# Altium project Beta_Prototype_Main_Board.PrjPcb (part 2 of 2)

## Sheet ShinStrap_Interface.SchDoc
size A3; Organization: Altium Limited; Address1: L3, 12a Rodborough Rd; Address2: Frenchs Forest; Address3: NSW; Address4: Australia 2086; DocumentNumber: 7; SheetNumber: 7; SheetTotal: 8
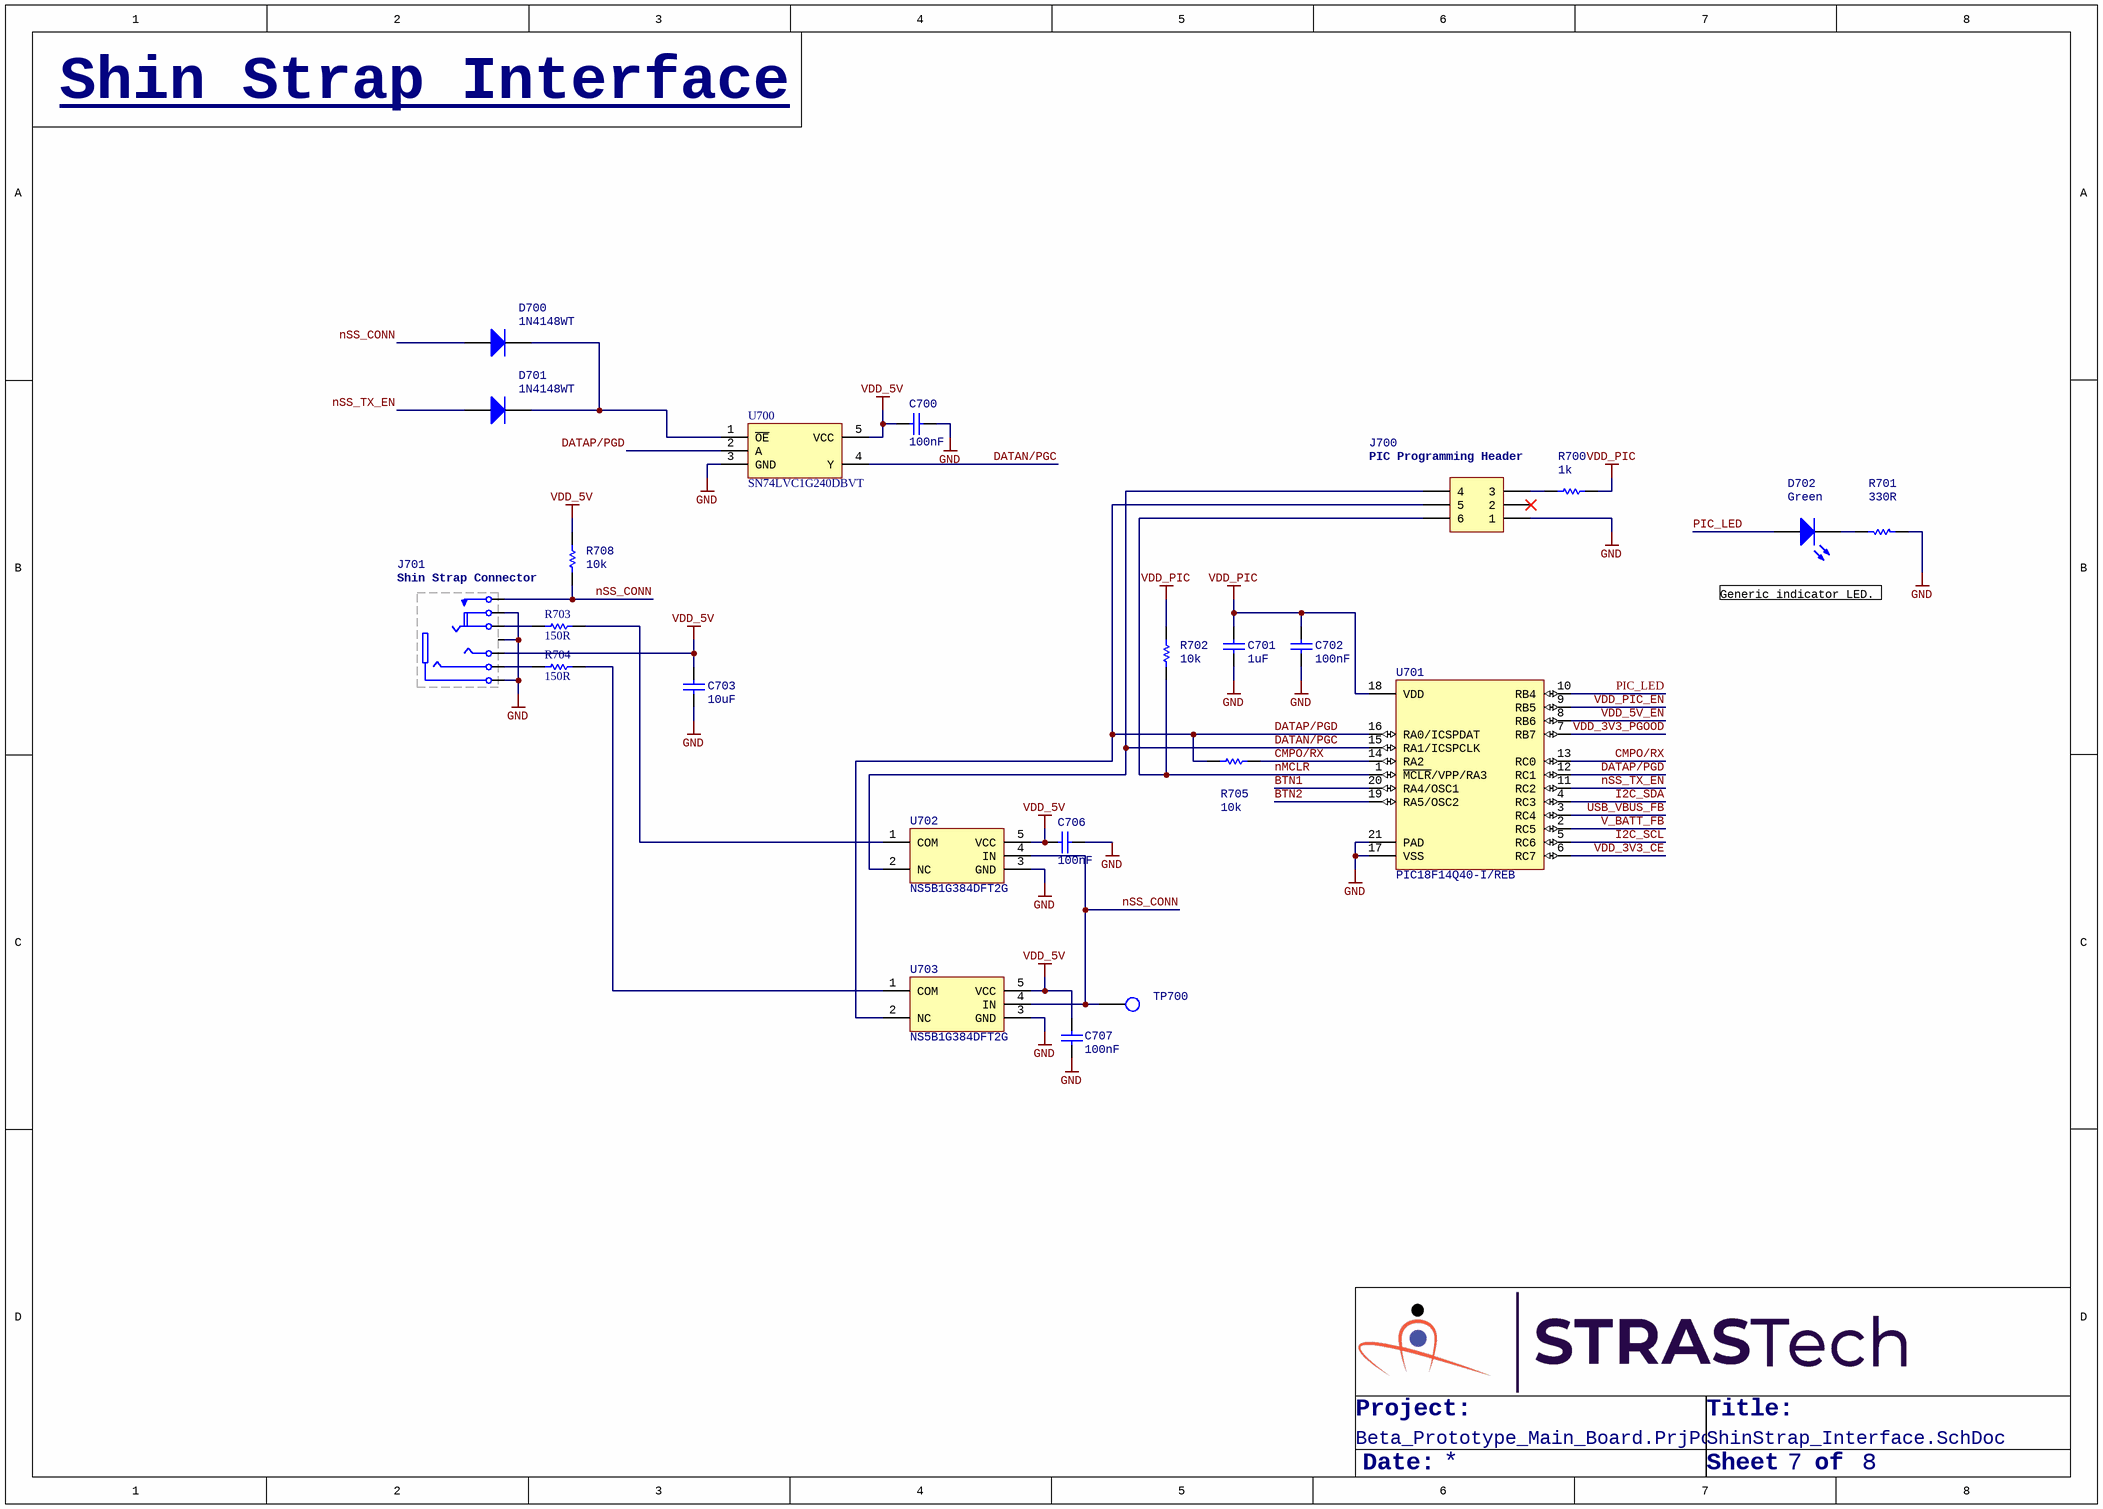
[diagram p7: ShinStrap_Interface.SchDoc]

### Parts
C700  100nF  [Cap,SMD,0402]
C701  1uF  [Cap,SMD,0402]
C702  100nF  [Cap,SMD,0402]
C703  10uF  [Cap,SMD,0402]
C706  100nF  [Cap,SMD,0402]
C707  100nF  [Cap,SMD,0402]
D700  1N4148WT  [SOD523]
D701  1N4148WT  [SOD523]
D702  Green  [LED,0603]
J700  Term,Header,3x2 Pin,1.27mm,SMD  [TERM,HEADER,3X2PIN,P1.27,SMD]  (value not drawn)
J701  Conn,Jack,TRS,3.5mm,Thru,Shielded  [Conn,Jack,TRS,3.5mm,Thru,Shielded]  (value not drawn)
R700  1k  [RES,0402]
R701  330R  [RES,0402]
R702  10k  [RES,0402]
R703  150R  [RES,0402]
R704  150R  [RES,0402]
R705  10k  [RES,0402]
R708  10k  [RES,0402]
TP700  TESTPOINT  [testpoint,smd,round,1mm]  (value not drawn)
U700  SN74LVC1G240DBVT  [sot23-5]
U701  PIC18F14Q40-I/REB  [IC,QFN-20,3x3,PAD,P0.4]
U702  NS5B1G384DFT2G  [SC70-5]
U703  NS5B1G384DFT2G  [SC70-5]

### Nets
GND: C700.1 C701.1 C702.1 C703.1 C706.2 C707.1 J700.1 J701.0(SH) J701.1(S) J701.5(IR1) R701.1 U700.3(GND) U701.17(VSS) U701.21(PAD) U702.3(GND) U703.3(GND)
VDD_5V: C700.2 C703.2 C706.1 C707.2 J701.2(T) R708.2 U700.5(VCC) U702.5(VCC) U703.5(VCC)
VDD_PIC: C701.2 C702.2 R700.2 R702.2 U701.18(VDD)
BTN1: U701.20(RA4/OSC1)
BTN2: U701.19(RA5/OSC2)
CMPO/RX: R705.1 U701.13(RC0) U701.14(RA2)
DATAN/PGC: J700.4 U700.4(Y) U701.15(RA1/ICSPCLK) U702.2(NC)
DATAP/PGD: J700.5 R705.2 U700.2(A) U701.12(RC1) U701.16(RA0/ICSPDAT) U703.2(NC)
I2C_SCL: U701.5(RC6)
I2C_SDA: U701.4(RC3)
nMCLR: J700.6 R702.1 U701.1(~{MCLR}/VPP/RA3)
nSS_CONN: D700.2(A) J701.6(R1S) R708.1 TP700.1(TP) U702.4(IN) U703.4(IN)
nSS_TX_EN: D701.2(A) U701.11(RC2)
PIC_LED: D702.1(A) U701.10(RB4)
USB_VBUS_FB: U701.3(RC4)
V_BATT_FB: U701.2(RC5)
VDD_3V3_CE: U701.6(RC7)
VDD_3V3_PGOOD: U701.7(RB7)
VDD_5V_EN: U701.8(RB6)
VDD_PIC_EN: U701.9(RB5)
NetD700_1: D700.1(K) D701.1(K) U700.1(~{OE})
NetD702_2: D702.2(K) R701.2
NetJ700_3: J700.3 R700.1
NetJ701_3: J701.3(R1) R703.1
NetJ701_4: J701.4(R2) R704.1
NetR703_2: R703.2 U702.1(COM)
NetR704_2: R704.2 U703.1(COM)

Not connected (* = marked no-connect by the designer): J700 2*

### Notes on the sheet
- Shin Strap Interface
- (near J700) PIC Programming Header
- (near J701) Shin Strap Connector
- Generic indicator LED.
- Project:
- Title:
- Date:
- Sheet
- of
- Title
- Size:
- A3
- Revision:
- Design By:

### Library data of the parts
C700 C702 C706 C707 = CAP,Cer,100nF,25VDC,X7R,0402: 0.1µF ±10% 25V Ceramic Capacitor X7R 0402 (1005 Metric); Vendor Part Number: 490-14603-1-ND; Manufacturer: Murata Electronics; Manufacturer Part Number: GRM155R71E104KE14J; Vendor: Digikey; HelpURL: https://search.murata.co.jp/Ceramy/image/img/A01X/G101/ENG/GRM155R71E104KE14-01.pdf; CreatedBy: Judd Foster
C701 = CAP,Cer,1uF,35VDC,X5R,0402: 1 µF ±10% 35V Ceramic Capacitor X5R 0402 (1005 Metric); Vendor Part Number: 445-9073-1-ND; Manufacturer: TDK Corporation; Manufacturer Part Number: C1005X5R1V105K050BC; Vendor: Digikey; HelpURL: https://product.tdk.com/info/en/catalog/datasheets/mlcc_commercial_general_en.pdf?ref_disty=digikey; CreatedBy: Judd Foster
C703 = CAP,Cer,10uF,10VDC,X5R,0402: 10 µF ±20% 10V Ceramic Capacitor X5R 0402 (1005 Metric); Vendor Part Number: 1276-1450-1-ND; Manufacturer: Samsung Electro-Mechanics; Manufacturer Part Number: CL05A106MP5NUNC; Vendor: Digikey; HelpURL: https://media.digikey.com/pdf/Data%20Sheets/Samsung%20PDFs/CL05A106MP5NUNC_Spec.pdf; CreatedBy: Judd Foster
D700 D701 = DIODE,Gen,75V,200mA,SOD523F: Diode Standard 75 V 200mA Surface Mount SOD-523F; Manufacturer: ON Semiconductor; Vendor Part Number: 1N4148WTCT-ND; Vendor: Digikey; CreatedBy: Judd Foster; HelpURL: https://rocelec.widen.net/view/pdf/bnxdzepaue/ONSM-S-A0003584797-1.pdf?t.download=true&u=5oefqw; Manufacturer Part Number: 1N4148WT
D702 = LED,Green,SMD,0603: Green 530nm LED Indication - Discrete 3V 0603 (1608 Metric); Manufacturer: Stanley Electric Co; Manufacturer Part Number: THG1111C-0005-TR; Vendor Part Number: 404-1286-1-ND; Vendor: Digikey; CreatedBy: Judd Foster; HelpURL: http://www.stanley-components.com/php/downloaddatafile.php?rp=0,THG1111C-0005_e.pdf
J700 = Term,Header,3x2 Pin,1.27mm,SMD: Connector Header Surface Mount 6 position 0.050" (1.27mm); Vendor Part Number: 609-3693-1-ND; Manufacturer: Amphenol ICC (FCI); Manufacturer Part Number: 20021121-00006C4LF; Vendor: Digikey; HelpURL: https://media.digikey.com/pdf/Data%20Sheets/FCI%20PDFs/Minitek%20127_Catalog.pdf; CreatedBy: Judd Foster
J701 = Conn,Jack,TRS,3.5mm,Thru,Shielded: 3.50mm (0.141", 1/8", Mini Plug) - Headphone Phone Jack Stereo (4 Conductor, TRRS) Connector Solder; Manufacturer: CUI Devices; Manufacturer Part Number: SJ-435107RS; Vendor Part Number: CP-435107RS-ND; Vendor: Digikey; CreatedBy: Judd Foster; HelpURL: https://www.cuidevices.com/product/resource/digikeypdf/sj-435107.pdf
R700 = RES,1k,5%,0.063W,0402: 1 kOhms ±5% 0.063W, 1/16W Chip Resistor 0402 (1005 Metric) Automotive AEC-Q200 Thick Film; Vendor Part Number: RMCF0402JT1K00CT-ND; Manufacturer: Stackpole Electronics Inc; Manufacturer Part Number: RMCF0402JT1K00; Vendor: DIgikey; HelpURL: https://www.seielect.com/catalog/sei-rmcf_rmcp.pdf; CreatedBy: Judd Foster
R701 = RES,330R,5%,0.063W,0402: 330 Ohms ±5% 0.063W, 1/16W Chip Resistor 0402 (1005 Metric) Automotive AEC-Q200 Thick Film; Manufacturer: Stackpole Electronics Inc; Manufacturer Part Number: RMCF0402JT330R; Vendor Part Number: RMCF0402JT330RCT-ND; Vendor: Digikey; CreatedBy: Judd Foster; HelpURL: https://www.seielect.com/catalog/sei-rmcf_rmcp.pdf
R702 R705 R708 = RES,10k,5%,0.063W,0402: 10 kOhms ±5% 0.063W, 1/16W Chip Resistor 0402 (1005 Metric) Automotive AEC-Q200 Thick Film; Vendor Part Number: RMCF0402JT10K0CT-ND; Manufacturer: Stackpole Electronics Inc; Manufacturer Part Number: RMCF0402JT10K0; Vendor: DIgikey; HelpURL: https://www.seielect.com/catalog/sei-rmcf_rmcp.pdf; CreatedBy: Judd Foster
R703 R704 = RES,150R,1%,0.1W,0402: 150 Ohms ±1% 0.063W, 1/16W Chip Resistor 0402 (1005 Metric) Automotive AEC-Q200, Moisture Resistant Thick Film; Manufacturer: TE Connectivity Passive Product; Manufacturer Part Number: CRGCQ0402F150R; Vendor Part Number: A129617CT-ND; Vendor: Digikey; CreatedBy: Judd Foster; HelpURL: https://www.te.com/commerce/DocumentDelivery/DDEController?Action=srchrtrv&DocNm=1773204-3&DocType=DS&DocLang=English
TP700 = TESTPOINT: PCB Testpoint; CreatedBy: Judd Foster; HelpURL: N/A; Manufacturer: N/A; Manufacturer Part Number: N/A; Vendor: N/A; Vendor Part Number: N/A
U700 = SN74LVC1G240DBVT: Buffer, Inverting 1 Element 1 Bit per Element 3-State Output SOT-23-5; Vendor Part Number: 296-32301-1-ND; Manufacturer: Texas Instruments; Vendor: Digikey; HelpURL: https://www.ti.com/general/docs/suppproductinfo.tsp?distId=10&gotoUrl=https%3A%2F%2Fwww.ti.com%2Flit%2Fgpn%2Fsn74lvc1g240; Manufacturer Part Number: SN74LVC1G240DBVT; CreatedBy: Judd Foster
U701 = PIC18F14Q40-I/REB: PIC series Microcontroller IC 8-Bit 64MHz 16KB (16K x 8) FLASH 20-VQFN (3x3); Manufacturer: Microchip Technology; Vendor Part Number: 150-PIC18F14Q40-I/REB-ND; Vendor: Digikey; CreatedBy: Judd Foster; HelpURL: https://ww1.microchip.com/downloads/en/DeviceDoc/PIC18F04-05-14-15-Q40-1420-Pin-Low-Power-High-Performance-Microcontroller-With-XLP-Technology-Data-Sheet-40002236B.pdf; Manufacturer Part Number: PIC18F14Q40-I/REB
U702 U703 = NS5B1G384DFT2G: 1 Circuit IC Switch 1:1 15Ohm SC-88A (SC-70-5/SOT-353); Manufacturer: onsemi; Vendor Part Number: NS5B1G384DFT2GOSCT-ND; Vendor: Digikey; CreatedBy: Judd Foster; HelpURL: https://www.onsemi.com/pdf/datasheet/ns5b1g384-d.pdf; Manufacturer Part Number: NS5B1G384DFT2G

## Nets that join several sheets
A_GND: Load_Cell_Biasing (9 pins), Load_Cell_Acquisition (16 pins), Peripherals_Main_Board (J400.1 J401.3 J402.3 J403.1), Regulation_Charging (C618.1 C619.1 C620.1)
GND: Processor (27 pins), USB_Serial (12 pins), Load_Cell_Acquisition (C202.1 C203.2 NT200.1 U201.19), Inertial_Measurement_RTC (16 pins), Peripherals_Main_Board (7 pins), Regulation_Charging (36 pins), ShinStrap_Interface (16 pins)
USB_VBUS: USB_Serial (5 pins), Regulation_Charging (8 pins)
VDD_3V3: Processor (22 pins), Load_Cell_Acquisition (L200.2 R208.2 R209.2), Inertial_Measurement_RTC (14 pins), Regulation_Charging (5 pins)
VDD_5V: Regulation_Charging (8 pins), ShinStrap_Interface (9 pins)
VDD_5VA: Load_Cell_Biasing (5 pins), Load_Cell_Acquisition (R200.2 R214.2), Peripherals_Main_Board (J400.3 J401.1 J402.1 J403.3), Regulation_Charging (5 pins)
VDD_PIC: Peripherals_Main_Board (R400.1 R401.1), Regulation_Charging (10 pins), ShinStrap_Interface (5 pins)
BTN1: Peripherals_Main_Board (R400.2 SW400.3 SW400.4), ShinStrap_Interface (U701.20)
BTN2: Peripherals_Main_Board (R401.2 SW401.3 SW401.4), ShinStrap_Interface (U701.19)
ESP32_CHIP_PU: Processor (5 pins), USB_Serial (Q800.3)
ESP32_GPIO0: Processor (R502.2 SW500.1 SW500.2 U500.5), USB_Serial (Q801.3)
ESP32_UART_RXD: Processor (R500.1 U500.50), USB_Serial (R805.2)
ESP32_UART_TXD: Processor (R501.2), USB_Serial (R804.2)
I2C_SCL: Processor (U500.41), Inertial_Measurement_RTC (R101.1 U100.A2 U101.13 U102.7), ShinStrap_Interface (U701.5)
I2C_SDA: Processor (U500.42), Inertial_Measurement_RTC (R102.1 U100.B2 U101.14 U102.6), ShinStrap_Interface (U701.4)
LED1: Processor (U500.43), Peripherals_Main_Board (D400.1)
LED2: Processor (U500.51), Peripherals_Main_Board (D401.1)
LED3: Processor (U500.52), Peripherals_Main_Board (D402.1)
LOAD_CELL_1: Load_Cell_Acquisition (R202.2), Peripherals_Main_Board (J400.2)
LOAD_CELL_2: Load_Cell_Acquisition (R201.2), Peripherals_Main_Board (J401.2)
LOAD_CELL_3: Load_Cell_Acquisition (R216.2), Peripherals_Main_Board (J402.2)
LOAD_CELL_4: Load_Cell_Acquisition (R215.2), Peripherals_Main_Board (J403.2)
LOAD_CELL_BIAS_12: Load_Cell_Biasing (C303.2 R300.1 U200.15), Load_Cell_Acquisition (R206.1)
LOAD_CELL_BIAS_34: Load_Cell_Biasing (C306.2 R310.1 U200.5), Load_Cell_Acquisition (R221.1)
MCP3561_nCS: Processor (U500.12), Load_Cell_Acquisition (R210.1)
nCHG_EN: Processor (U500.23), Regulation_Charging (R608.2 U600.6)
nCHG_OK: Processor (U500.44), Regulation_Charging (R602.2 U600.11)
PCM1780_BCK: Processor (U500.24), Load_Cell_Biasing (R309.1)
PCM1780_DATA: Processor (U500.16), Load_Cell_Biasing (R306.1)
PCM1780_LRCK: Processor (U500.27), Load_Cell_Biasing (R308.1)
PCM1780_MC: Processor (U500.38), Load_Cell_Biasing (R302.1)
PCM1780_MD: Processor (U500.37), Load_Cell_Biasing (R303.1)
PCM1780_nMS: Processor (U500.39), Load_Cell_Biasing (R301.1)
PCM1780_SCK: Processor (U500.36), Load_Cell_Biasing (R307.1)
SPI_SCK: Processor (U500.13), Load_Cell_Acquisition (R211.1)
SPI_SDI: Processor (U500.18), Load_Cell_Acquisition (R212.1)
SPI_SDO: Processor (U500.19), Load_Cell_Acquisition (R213.1)
USB_VBUS_FB: Regulation_Charging (C624.2 R604.1 R609.2 TP603.1), ShinStrap_Interface (U701.3)
V_BATT_FB: Regulation_Charging (C623.1 R600.1 R601.2 TP600.1), ShinStrap_Interface (U701.2)
VDD_3V3_CE: Regulation_Charging (R617.2 TP606.1 U602.4), ShinStrap_Interface (U701.6)
VDD_3V3_PGOOD: Regulation_Charging (R614.1 TP605.1 U602.3), ShinStrap_Interface (U701.7)
VDD_5V_EN: Regulation_Charging (R623.2), ShinStrap_Interface (U701.8)
VDD_5V_FB: Processor (U500.8), Regulation_Charging (C622.1 R620.1 R622.2 TP609.1)
VDD_5VA_EN: Processor (U500.40), Regulation_Charging (R619.2)
VDD_PIC_EN: Regulation_Charging (R611.2 TP602.1 U601.2), ShinStrap_Interface (U701.9)